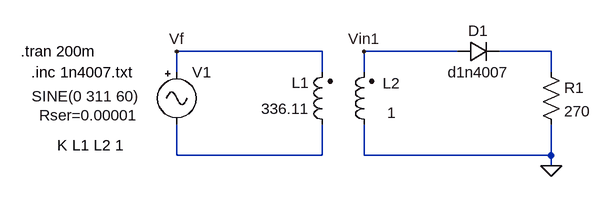
[diagram p0: schematic relat2p1.asc]
relat2p1.asc, the LTspice schematic file:
Version 4
SHEET 1 880 680
WIRE 128 64 -96 64
WIRE 336 64 192 64
WIRE 480 64 400 64
WIRE -96 96 -96 64
WIRE 128 96 128 64
WIRE 192 96 192 64
WIRE 480 96 480 64
WIRE -96 224 -96 176
WIRE 128 224 128 176
WIRE 128 224 -96 224
WIRE 192 224 192 176
WIRE 480 224 480 176
WIRE 480 224 192 224
WIRE 480 240 480 224
FLAG -96 64 Vf
FLAG 192 64 Vin1
FLAG 480 240 0
SYMBOL Misc\\signal -96 80 R0
WINDOW 123 0 0 Left 0
WINDOW 39 -212 82 Left 2
WINDOW 3 -223 53 Left 2
SYMATTR SpiceLine Rser=0.00001
SYMATTR Value SINE(0 311 60)
SYMATTR InstName V1
SYMBOL ind2 144 192 R180
WINDOW 0 36 80 Left 2
WINDOW 3 36 40 Left 2
SYMATTR InstName L1
SYMATTR Value 336.11
SYMATTR Type ind
SYMBOL ind2 208 192 R180
WINDOW 0 -40 79 Left 2
WINDOW 3 -33 34 Left 2
SYMATTR InstName L2
SYMATTR Value 1
SYMATTR Type ind
SYMBOL diode 336 80 R270
WINDOW 0 32 32 VTop 2
WINDOW 3 0 32 VBottom 2
SYMATTR InstName D1
SYMATTR Value d1n4007
SYMBOL res 464 80 R0
SYMATTR InstName R1
SYMATTR Value 270
TEXT -336 64 Left 2 !.tran 200m
TEXT -280 208 Left 2 !K L1 L2 1
TEXT -320 96 Left 2 !.inc 1n4007.txt

The netlist it stands for:
* relat2p1.asc
V1 Vf N002 SINE(0 311 60) Rser=0.00001
L1 N002 Vf 336.11
L2 0 Vin1 1
D1 Vin1 N001 d1n4007
R1 N001 0 270
.model D D
.lib standard.dio
.tran 200m
K L1 L2 1
.inc 1n4007.txt
.backanno
.end